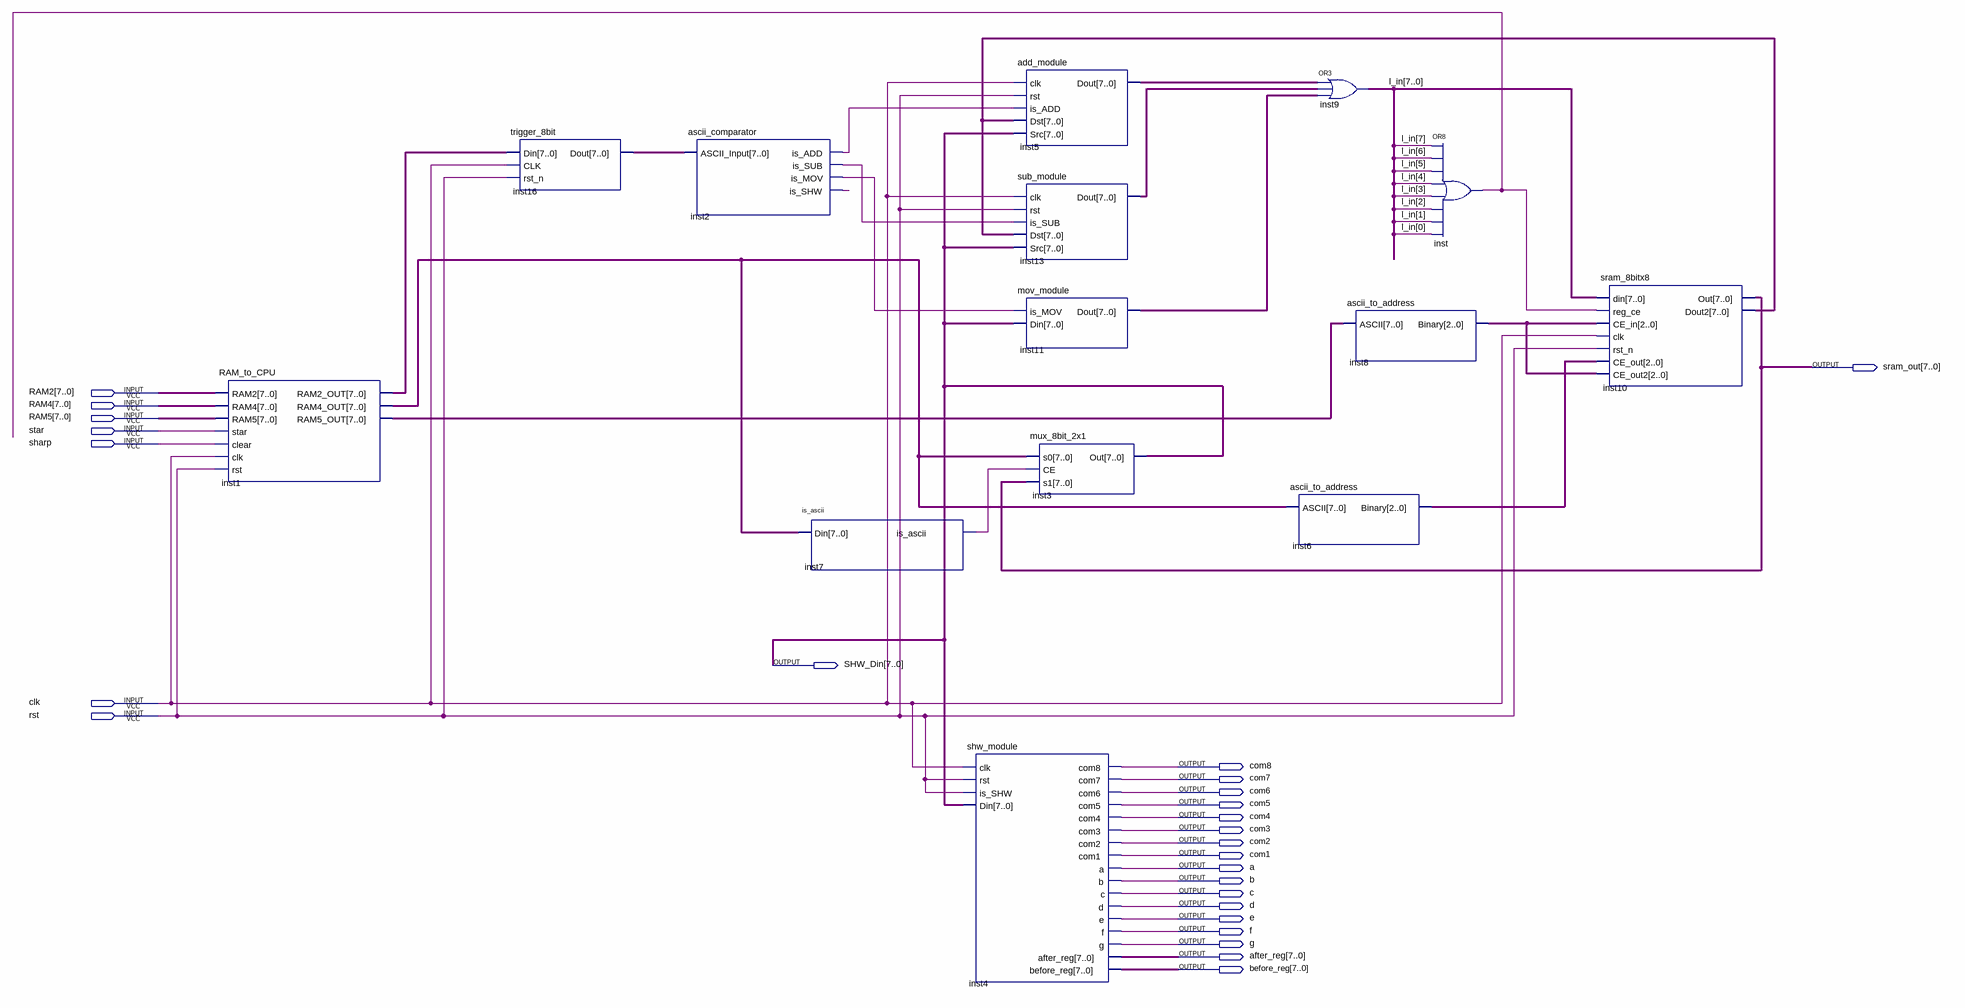
[diagram p0: schematic sheet]
// Quartus schematic CPU_MEMORY.bdf as structural Verilog: 14 symbols, 26 pins
module CPU_MEMORY (
  input  [7:0] RAM2,
  input  [7:0] RAM4,
  input  [7:0] RAM5,
  input  star,
  input  sharp,
  input  clk,
  input  rst,
  output [7:0] sram_out,
  output [7:0] SHW_Din,
  output com8,
  output com7,
  output com6,
  output com5,
  output com4,
  output com3,
  output com2,
  output com1,
  output a,
  output b,
  output c,
  output d,
  output e,
  output f,
  output g,
  output [7:0] after_reg,
  output [7:0] before_reg
);

  wire inst2_is_add, inst2_is_mov, inst2_is_shw, inst2_is_sub, inst7_is_ascii, inst_out;
  wire [2:0] inst6_binary, inst8_binary;
  wire [7:0] inst1_ram2_out, inst1_ram4_out, inst1_ram5_out, inst5_dout, inst10_dout2, inst11_dout,
       inst13_dout, inst16_dout, l_in;

  RAM_to_CPU inst1 (
    .RAM2(RAM2), .RAM4(RAM4), .RAM5(RAM5), .star(star), .clear(sharp), .clk(clk), .rst(rst),
    .RAM2_OUT(inst1_ram2_out), .RAM4_OUT(inst1_ram4_out), .RAM5_OUT(inst1_ram5_out));
  trigger_8bit inst16 (.Din(inst1_ram2_out), .CLK(clk), .rst_n(rst), .Dout(inst16_dout));
  ascii_comparator inst2 (
    .ASCII_Input(inst16_dout), .is_ADD(inst2_is_add), .is_SUB(inst2_is_sub), .is_MOV(inst2_is_mov),
    .is_SHW(inst2_is_shw));
  is_ascii inst7 (.Din(inst1_ram4_out), .is_ascii(inst7_is_ascii));
  shw_module inst4 (
    .clk(clk), .rst(rst), .is_SHW(rst), .Din(SHW_Din), .com8(com8), .com7(com7), .com6(com6), .com5(com5),
    .com4(com4), .com3(com3), .com2(com2), .com1(com1), .a(a), .b(b), .c(c), .d(d), .e(e), .f(f), .g(g),
    .after_reg(after_reg), .before_reg(before_reg));
  add_module inst5 (.clk(clk), .rst(rst), .is_ADD(inst2_is_add), .Dst(inst10_dout2), .Src(SHW_Din), .Dout(inst5_dout));
  sub_module inst13 (
    .clk(clk), .rst(rst), .is_SUB(inst2_is_sub), .Dst(inst10_dout2), .Src(SHW_Din), .Dout(inst13_dout));
  mov_module inst11 (.is_MOV(inst2_is_mov), .Din(SHW_Din), .Dout(inst11_dout));
  mux_8bit_2x1 inst3 (.s0(inst1_ram4_out), .CE(inst7_is_ascii), .s1(sram_out), .Out(SHW_Din));
  ascii_to_address inst6 (.ASCII(inst1_ram4_out), .Binary(inst6_binary));
  assign l_in = inst5_dout | inst13_dout | inst11_dout;  // OR3 inst9, 8 bits wide
  ascii_to_address inst8 (.ASCII(inst1_ram5_out), .Binary(inst8_binary));
  or inst (inst_out, l_in[7], l_in[6], l_in[5], l_in[4], l_in[3], l_in[2], l_in[1], l_in[0]);
  sram_8bitx8 inst10 (
    .din(l_in), .reg_ce(inst_out), .CE_in(inst8_binary), .clk(clk), .rst_n(rst), .CE_out(inst6_binary),
    .CE_out2(inst8_binary), .Out(sram_out), .Dout2(inst10_dout2));
endmodule
